# Altium schematic sheet Debugger.SchDoc
size A4; Author: İlker KESER; Revision: V1.0; SheetNumber: 6; SheetTotal: 9; Page: 6; Page Total: 9; Project Code: 02050838; Template: A3
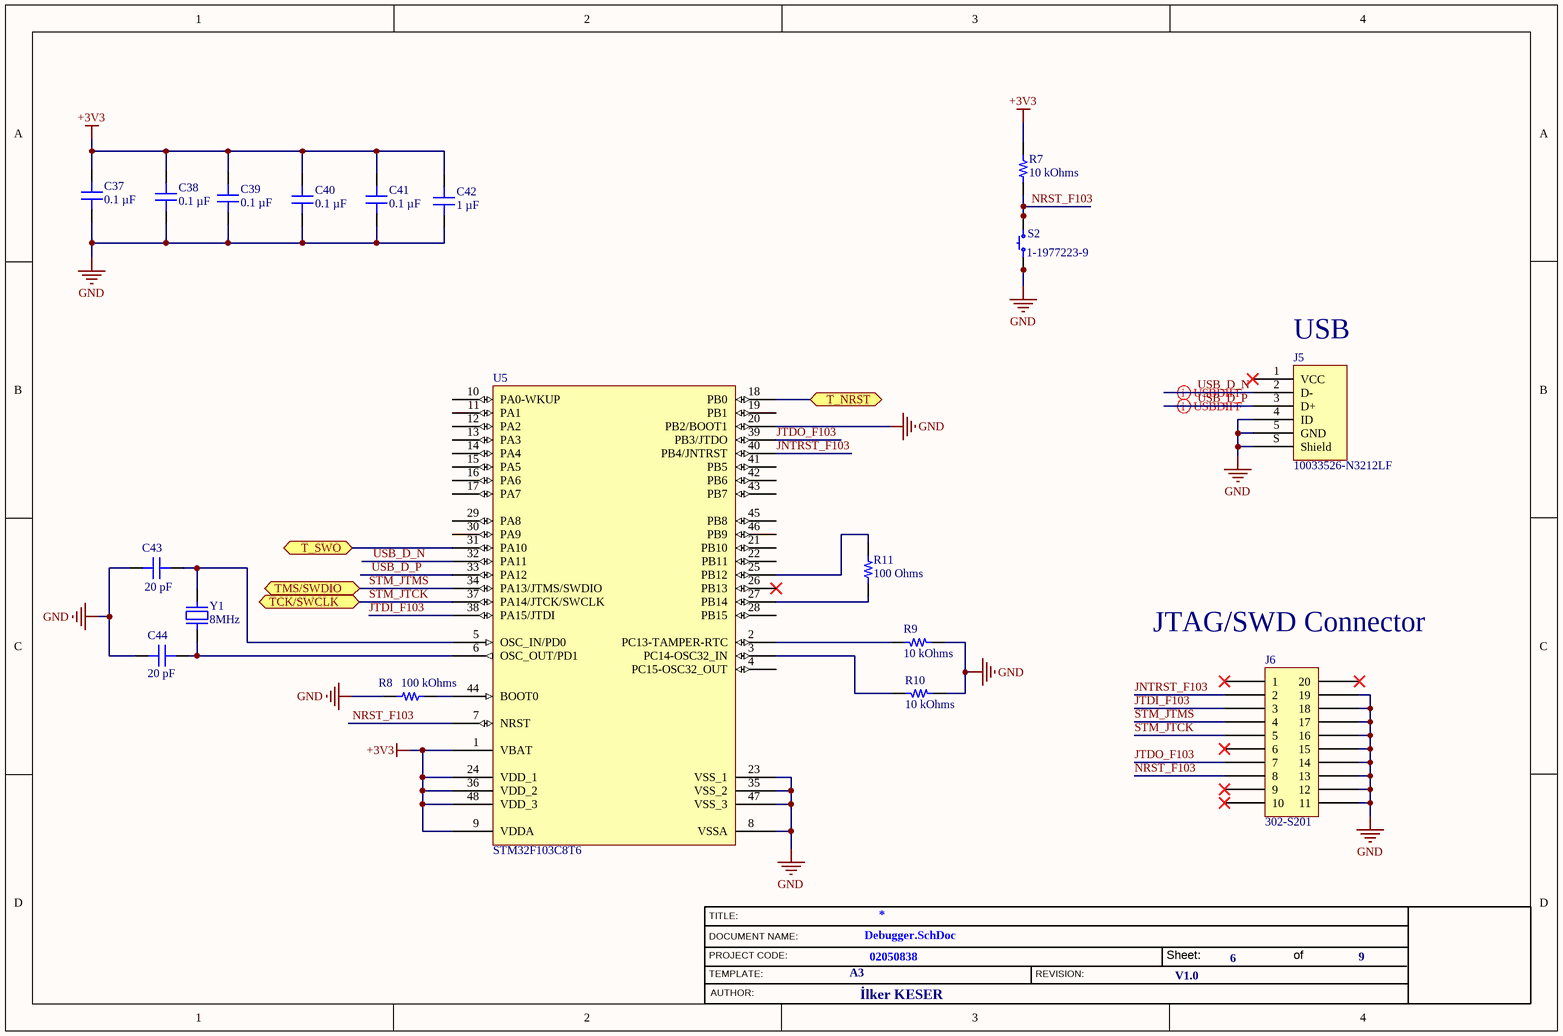
[diagram p0: Debugger.SchDoc]

## Parts
C37  0.1 µF  [CAP 0402_1005]
C38  0.1 µF  [CAP 0402_1005]
C39  0.1 µF  [CAP 0402_1005]
C40  0.1 µF  [CAP 0402_1005]
C41  0.1 µF  [CAP 0402_1005]
C42  1 µF  [CAP 0402_1005]
C43  20 pF  [CAP 0402_1005]
C44  20 pF  [CAP 0402_1005]
J5  10033526-N3212LF  [FCI USB 10033526-N3212LF]
J6  302-S201  [OST 302-S201]
R7  10 kOhms  [KOA RES RK73 RN73 0402_1005]
R8  100 kOhms  [YAGEO RES 0402_1005]
R9  10 kOhms  [KOA RES RK73 RN73 0402_1005]
R10  10 kOhms  [KOA RES RK73 RN73 0402_1005]
R11  100 Ohms  [YAGEO RES 0402_1005]
S2  1-1977223-9  [TE FSM6JSMA]
U5  STM32F103C8T6  [LQFP48_L]
Y1  8MHz  [TXC 9C]

## Ports
T_NRST (bidir, see Microcontroller[2C]), T_SWO (bidir, see Microcontroller[2A]), TCK/SWCLK (bidir, see Microcontroller[1B]), TMS/SWDIO (bidir, see Microcontroller[1B])

## Nets
+3V3: C37.2 C38.2 C39.2 C40.2 C41.2 C42.2 R7.1 U5.1(VBAT) U5.9(VDDA) U5.24(VDD_1) U5.36(VDD_2) U5.48(VDD_3)
GND: C37.1 C38.1 C39.1 C40.1 C41.1 C42.1 C43.1 C44.1 J5.4(ID) J5.5(GND) J5.S(Shield) J6.11 J6.12 J6.13 J6.14 J6.15 J6.16 J6.17 J6.18 J6.19 R8.1 R9.2 R10.2 S2.1 S2.2 U5.8(VSSA) U5.20(PB2/BOOT1) U5.23(VSS_1) U5.35(VSS_2) U5.47(VSS_3)
JNTRST_F103: J6.2 U5.40(PB4/JNTRST)
JTDI_F103: J6.3 U5.38(PA15/JTDI)
JTDO_F103: J6.7 U5.39(PB3/JTDO)
NRST_F103: J6.8 R7.2 S2.3 S2.4 U5.7(NRST)
STM_JTCK: J6.5 U5.37(PA14/JTCK/SWCLK) ; port TCK/SWCLK
STM_JTMS: J6.4 U5.34(PA13/JTMS/SWDIO) ; port TMS/SWDIO
T_NRST: U5.18(PB0) ; port T_NRST
T_SWO: U5.31(PA10) ; port T_SWO
USB_D_N: J5.2(D-) U5.32(PA11)
USB_D_P: J5.3(D+) U5.33(PA12)
NetC43_2: C43.2 U5.5(OSC_IN/PD0) Y1.2
NetC44_2: C44.2 U5.6(OSC_OUT/PD1) Y1.1
NetR8_2: R8.2 U5.44(BOOT0)
NetR9_1: R9.1 U5.2(PC13-TAMPER-RTC)
NetR10_1: R10.1 U5.3(PC14-OSC32_IN)
NetR11_1: R11.1 U5.27(PB14)
NetR11_2: R11.2 U5.25(PB12)

Not connected (* = marked no-connect by the designer): J5 1(VCC)*; J6 1* 6* 9* 10* 20*; U5 4(PC15-OSC32_OUT) 10(PA0-WKUP) 11(PA1) 12(PA2) 13(PA3) 14(PA4) 15(PA5) 16(PA6) 17(PA7) 19(PB1) 21(PB10) 22(PB11) 26(PB13)* 28(PB15) 29(PA8) 30(PA9) 41(PB5) 42(PB6) 43(PB7) 45(PB8) 46(PB9)

## Layout directives
differential pair; differential pair class USB_DIFF: USB_D_N, USB_D_P

## Notes on the sheet
- (near J5) USB
- (near J6) JTAG/SWD Connector
- TITLE:
- DOCUMENT NAME:
- PROJECT CODE:
- TEMPLATE:
- REVISION:
- Sheet:
- of
- AUTHOR:

## Library data of the parts
C37-C41 = C0402C104M9PAC7867: CAP CER 0.1UF 6.3V X5R 0402; manufacturer: KEMET; Tolerance: ±20%; Part Number: C0402C104M9PAC7867; Capacitance: 0.1 µF; Applications: Bypass, Decoupling; componentlink1description: Datasheet; componentlink1url: https://api.kemet.com/component-edge/download/datasheet/C0402C104M9PACTU.pdf; componentlink2description: DigiKey Link; componentlink2url: https://www.digikey.com/en/products/detail/kemet/C0402C104M9PAC7867/2196244; Device Package: 0402 (1005 Metric); lastupdated: 9.02.2024 20:04:15; Lifecycle Status: Active; Minimum Order: 1; Mounting Type: Surface Mount, MLCC; Operating Temperature: -55°C ~ 85°C; Package / Case: 0402 (1005 Metric); packaging: CutTape; partid: 33676; Part Status: Active; price: 0.01; series: SMD Comm X5R; Size / Dimension: 0.039" L x 0.020" W (1.00mm x 0.50mm); Supplier 1: DigiKey; Supplier Part Number 1: 399-C0402C104M9PAC7867CT-ND; Temperature Coefficient: X5R; Thickness (Max): 0.022" (0.55mm); value: 0.1 µF; Voltage - Rated: 6.3V
C42 = GRM152R60J105ME15D: CAP CER 1UF 6.3V X5R 0402; manufacturer: Murata Electronics; Tolerance: ±20%; Part Number: GRM152R60J105ME15D; Capacitance: 1 µF; Applications: General Purpose; componentlink1description: Datasheet; componentlink1url: https://search.murata.co.jp/Ceramy/image/img/A01X/G101/ENG/GRM152R60J105ME15-01.pdf; componentlink2description: DigiKey Link; componentlink2url: https://www.digikey.com/en/products/detail/murata-electronics/GRM152R60J105ME15D/4904809; Device Package: 0402 (1005 Metric); lastupdated: 9.02.2024 20:04:33; Lifecycle Status: Active; Minimum Order: 1; Mounting Type: Surface Mount, MLCC; Operating Temperature: -55°C ~ 85°C; Package / Case: 0402 (1005 Metric); packaging: TapeAndReel; partid: 4147; Part Status: Active; price: 0.03; series: GRM; Size / Dimension: 0.039" L x 0.020" W (1.00mm x 0.50mm); Supplier 1: DigiKey; Supplier Part Number 1: 490-10006-1-ND; Temperature Coefficient: X5R; Thickness (Max): 0.009" (0.22mm); value: 1 µF; Voltage - Rated: 6.3V
C43 C44 = C0402C200K8GAC7867: CAP CER 20PF 10V NP0 0402; manufacturer: KEMET; Temperature Coefficient: C0G, NP0; Tolerance: ±10%; Part Number: C0402C200K8GAC7867; Capacitance: 20 pF; Applications: General Purpose; componentlink1description: Datasheet; componentlink1url: https://api.kemet.com/component-edge/download/datasheet/C0402C200K8GACTU.pdf; componentlink2description: DigiKey Link; componentlink2url: https://www.digikey.com/en/products/detail/kemet/C0402C200K8GAC7867/2196419; Device Package: 0402 (1005 Metric); Features: Low ESL; lastupdated: 9.02.2024 20:04:30; Lifecycle Status: Active; Minimum Order: 1; Mounting Type: Surface Mount, MLCC; Operating Temperature: -55°C ~ 125°C; Package / Case: 0402 (1005 Metric); packaging: TapeAndReel; partid: 6572; Part Status: Active; price: 0.06; series: SMD Comm C0G; Size / Dimension: 0.039" L x 0.020" W (1.00mm x 0.50mm); Supplier 1: DigiKey; Supplier Part Number 1: 399-14429-1-ND; Thickness (Max): 0.022" (0.55mm); value: 20 pF; Voltage - Rated: 10V
J5 = 10033526-N3212LF: CONN RCPT MINI USB B 5POS SMD RA; Manufacturer: Amphenol ICC (FCI); Connector Type: USB - mini B; Current Rating (Amps): 1A per Contact; Gender: Receptacle; Mating Cycles: 5000; Number of Contacts: 5; Number of Ports: 1; Shielding: Shielded; Voltage - Rated: 30V; Part Number: 10033526-N3212LF; ComponentLink1Description: Datasheet; ComponentLink1URL: http://www.amphenol-icc.com/media/wysiwyg/files/drawing/10033526.pdf; ComponentLink2Description: DigiKey Link; ComponentLink2URL: //digikey.com/product-detail/en/amphenol-icc-fci/10033526-N3212LF/609-4700-2-ND/4292074; Features: Board Guide, Solder Retention; LastUpdated: 9.12.2019 20:52:14; Lifecycle Status: 0; Minimum Order: 1; Mounting Feature: Horizontal; Mounting Type: Surface Mount, Right Angle; Operating Temperature: -25°C ~ 85°C; Packaging: TapeAndReel; Part Status: Active; Price: 0.39; Series: -; Supplier 1: DigiKey; Supplier Part Number 1: 609-4700-2-ND; Termination: Solder
J6 = 302-S201: CONN HEADER VERT 20POS 2.54MM; Manufacturer: On Shore Technology Inc.; Contact Length - Post: 0.122" (3.10mm); Current Rating (Amps): 3A; Material Flammability Rating: UL94 V-0; Number of Positions: 20; Number of Positions Loaded: All; Pitch - Mating: 0.100" (2.54mm); Shrouding: Shrouded - 4 Wall; Style: Board to Cable/Wire; Part Number: 302-S201; ComponentLink1Description: Datasheet; ComponentLink1URL: http://www.on-shore.com/wp-content/uploads/2018/04/302-SXX1.pdf; ComponentLink2Description: DigiKey Link; ComponentLink2URL: https://www.digikey.com/en/products/detail/on-shore-technology-inc/302-S201/2794235; Connector Type: Header; Contact Finish - Mating: Gold; Contact Finish - Post: Gold; Contact Finish Thickness - Mating: Flash; Contact Material: Brass; Contact Shape: Square; Contact Type: Male Pin; Fastening Type: Push-Pull; Features: Keying Slot; Insulation Color: Black; Insulation Height: 0.358" (9.10mm); Insulation Material: Polyester, Glass Filled; LastUpdated: 14.08.2022 17:03:46; Lifecycle Status: Active; Minimum Order: 1; Mounting Type: Through Hole; Number of Rows: 2; Operating Temperature: -40°C ~ 105°C; Packaging: Tray; PartId: 155; Part Status: Active; Price: 0.19; Row Spacing - Mating: 0.100" (2.54mm); Series: 302; Supplier 1: DigiKey; Supplier Part Number 1: ED10524-ND; Termination: Solder
R7 R9 R10 = RK73H1ETTP1002D: RES 10K OHM 0.5% 1/10W 0402; Manufacturer: KOA Speer Electronics, Inc.; Power (Watts): 0.1W, 1/10W; Temperature Coefficient: ±100ppm/°C; Part Number: RK73H1ETTP1002D; Value: 10 kOhms; ComponentLink1Description: Datasheet; ComponentLink1URL: http://www.koaspeer.com/catimages/Products/RK73H/RK73H.pdf; ComponentLink2Description: DigiKey Link; ComponentLink2URL: https://www.digikey.com/en/products/detail/koa-speer-electronics-inc/RK73H1ETTP1002D/9844692; Composition: Thick Film; Device Package: 0402 (1005 Metric); Features: Automotive AEC-Q200; Height - Seated (Max): 0.016" (0.40mm); LastUpdated: 25.07.2024 09:41:31; Lifecycle Status: Active; Minimum Order: 1; Number of Terminations: 2; Operating Temperature: -55°C ~ 155°C; Package / Case: 0402 (1005 Metric); Packaging: TapeAndReel; PartId: 14647; Part Status: Active; Price: 0.03; Ratings: AEC-Q200; Resistance: 10 kOhms; Series: RK73H; Size / Dimension: 0.039" L x 0.020" W (1.00mm x 0.50mm); Supplier 1: DigiKey; Supplier Part Number 1: 2019-RK73H1ETTP1002DCT-ND; Supplier Device Package: 0402; Tolerance: ±0.5%
R8 = RP0402BRD07100KL: RES 100K OHM 0.1% 1/16W 0402; Manufacturer: Yageo; Power (Watts): 0.063W, 1/16W; Temperature Coefficient: ±25ppm/°C; Part Number: RP0402BRD07100KL; Value: 100 kOhms; ComponentLink1Description: Datasheet; ComponentLink1URL: https://www.yageo.com/upload/media/product/products/datasheet/rchip/PYu-RP_51_RoHS_L_0.pdf; ComponentLink2Description: DigiKey Link; ComponentLink2URL: https://www.digikey.com/en/products/detail/yageo/RP0402BRD07100KL/16916706; Composition: Thin Film; Device Package: 0402 (1005 Metric); Features: Anti-Sulfur, Automotive AEC-Q200, Moisture Resistant; Height - Seated (Max): 0.014" (0.35mm); LastUpdated: 25.07.2024 09:18:00; Lifecycle Status: Active; Minimum Order: 1; Number of Terminations: 2; Operating Temperature: -55°C ~ 155°C; Package / Case: 0402 (1005 Metric); Packaging: TapeAndReel; PartId: 70016; Part Status: Active; Price: 0.06; Resistance: 100 kOhms; Series: RP; Size / Dimension: 0.039" L x 0.020" W (1.00mm x 0.50mm); Supplier 1: DigiKey; Supplier Part Number 1: 13-RP0402BRD07100KLCT-ND; Supplier Device Package: 0402; Tolerance: ±0.1%
R11 = RP0402BRD07100RL: RES 100 OHM 0.1% 1/16W 0402; Manufacturer: Yageo; Power (Watts): 0.063W, 1/16W; Temperature Coefficient: ±25ppm/°C; Part Number: RP0402BRD07100RL; Value: 100 Ohms; ComponentLink1Description: Datasheet; ComponentLink1URL: https://www.yageo.com/upload/media/product/products/datasheet/rchip/PYu-RP_51_RoHS_L_0.pdf; ComponentLink2Description: DigiKey Link; ComponentLink2URL: https://www.digikey.com/en/products/detail/yageo/RP0402BRD07100RL/16916732; Composition: Thin Film; Device Package: 0402 (1005 Metric); Features: Anti-Sulfur, Automotive AEC-Q200, Moisture Resistant; Height - Seated (Max): 0.014" (0.35mm); LastUpdated: 25.07.2024 09:18:00; Lifecycle Status: Active; Minimum Order: 1; Number of Terminations: 2; Operating Temperature: -55°C ~ 155°C; Package / Case: 0402 (1005 Metric); Packaging: TapeAndReel; PartId: 69963; Part Status: Active; Price: 0.06; Resistance: 100 Ohms; Series: RP; Size / Dimension: 0.039" L x 0.020" W (1.00mm x 0.50mm); Supplier 1: DigiKey; Supplier Part Number 1: 13-RP0402BRD07100RLCT-ND; Supplier Device Package: 0402; Tolerance: ±0.1%
S2 = 1-1977223-9: SWITCH TACTILE SPST-NO 0.05A 24V; Manufacturer: TE Connectivity ALCOSWITCH Switches; Actuator Height off PCB, Vertical: 7.00mm; Actuator Orientation: Top Actuated; Actuator Type: Standard; Contact Rating @ Voltage: 0.05A @ 24VDC; Illumination: Non-Illuminated; Operating Force: 260gf; Outline: 6.00mm x 6.00mm; Switch Function: Off-Mom; Part Number: 1-1977223-9; Circuit: SPST-NO; ComponentLink1Description: Datasheet; ComponentLink1URL: https://www.te.com/commerce/DocumentDelivery/DDEController?Action=srchrtrv&DocNm=1308111-1_SWITCHES_CORE_PROGRAM_CATALOG&DocType=CS&DocLang=English; ComponentLink2Description: DigiKey Link; ComponentLink2URL: http://digikey.com/product-detail/en/te-connectivity-alcoswitch-switches/1-1977223-9/1-1977223-9-ND/5401299; LastUpdated: 3.06.2024 20:19:31; Lifecycle Status: Active; Minimum Order: 1500; Mounting Type: Surface Mount; Packaging: Bulk; Price: 0.36; Series: FSMJSMA; Supplier 1: DigiKey; Supplier Part Number 1: 1-1977223-9-ND; Termination Style: Gull Wing
U5 = STM32F103C8T6: STM32 ARM-based 32-bit MCU with 64 Kbytes Flash, 48-pin LQFP, Industrial Temperature; Published: 30-May-2008; DatasheetVersion: rev6, Mar-2008; PackageVersion: Mar-2008; PackageReference: LQFP48; Publisher: Altium Limited; PackageDescription: 48-Pin Low-Profile Quad Flat Pack, 7 x 7 mm Body, 0.5 mm Pitch (LQFP48); ComponentLink1Description: Manufacturer Link; ComponentLink1URL: www.st.com/stm32; ComponentLink2Description: Datasheet; ComponentLink2URL: http://www.st.com/stonline/products/literature/ds/13587.pdf
Y1 = 9C-8.000MBBK-T: CRYSTAL 8.0000MHZ 20PF SMD; Manufacturer: TXC CORPORATION; ESR (Equivalent Series Resistance): 80 Ohms; Frequency Stability: ±50ppm; Operating Mode: Fundamental; Part Number: 9C-8.000MBBK-T; ComponentLink1Description: Datasheet; ComponentLink1URL: http://www.txccorp.com/download/products/quartz_crystals/2015TXC_9C_32.pdf; ComponentLink2Description: DigiKey Link; ComponentLink2URL: http://digikey.com/product-detail/en/txc-corporation/9C-8.000MBBK-T/887-2475-1-ND/4475454; Frequency: 8MHz; Frequency Tolerance: ±50ppm; Height - Seated (Max): 0.161" (4.10mm); LastUpdated: 3.06.2024 20:02:24; Lifecycle Status: Active; Load Capacitance: 20pF; Minimum Order: 1; Mounting Type: Surface Mount; Operating Temperature: -20°C ~ 70°C; Package / Case: HC-49S; Packaging: TapeAndReel; PartId: 697; Part Status: Active; Price: 0.18; Series: 9C; Size / Dimension: 0.449" L x 0.189" W (11.40mm x 4.80mm); Supplier 1: DigiKey; Supplier Part Number 1: 887-2475-1-ND; Type: MHz Crystal; Value: 8MHz